# EAGLE design IRRxTx (EAGLE 7.1.0)
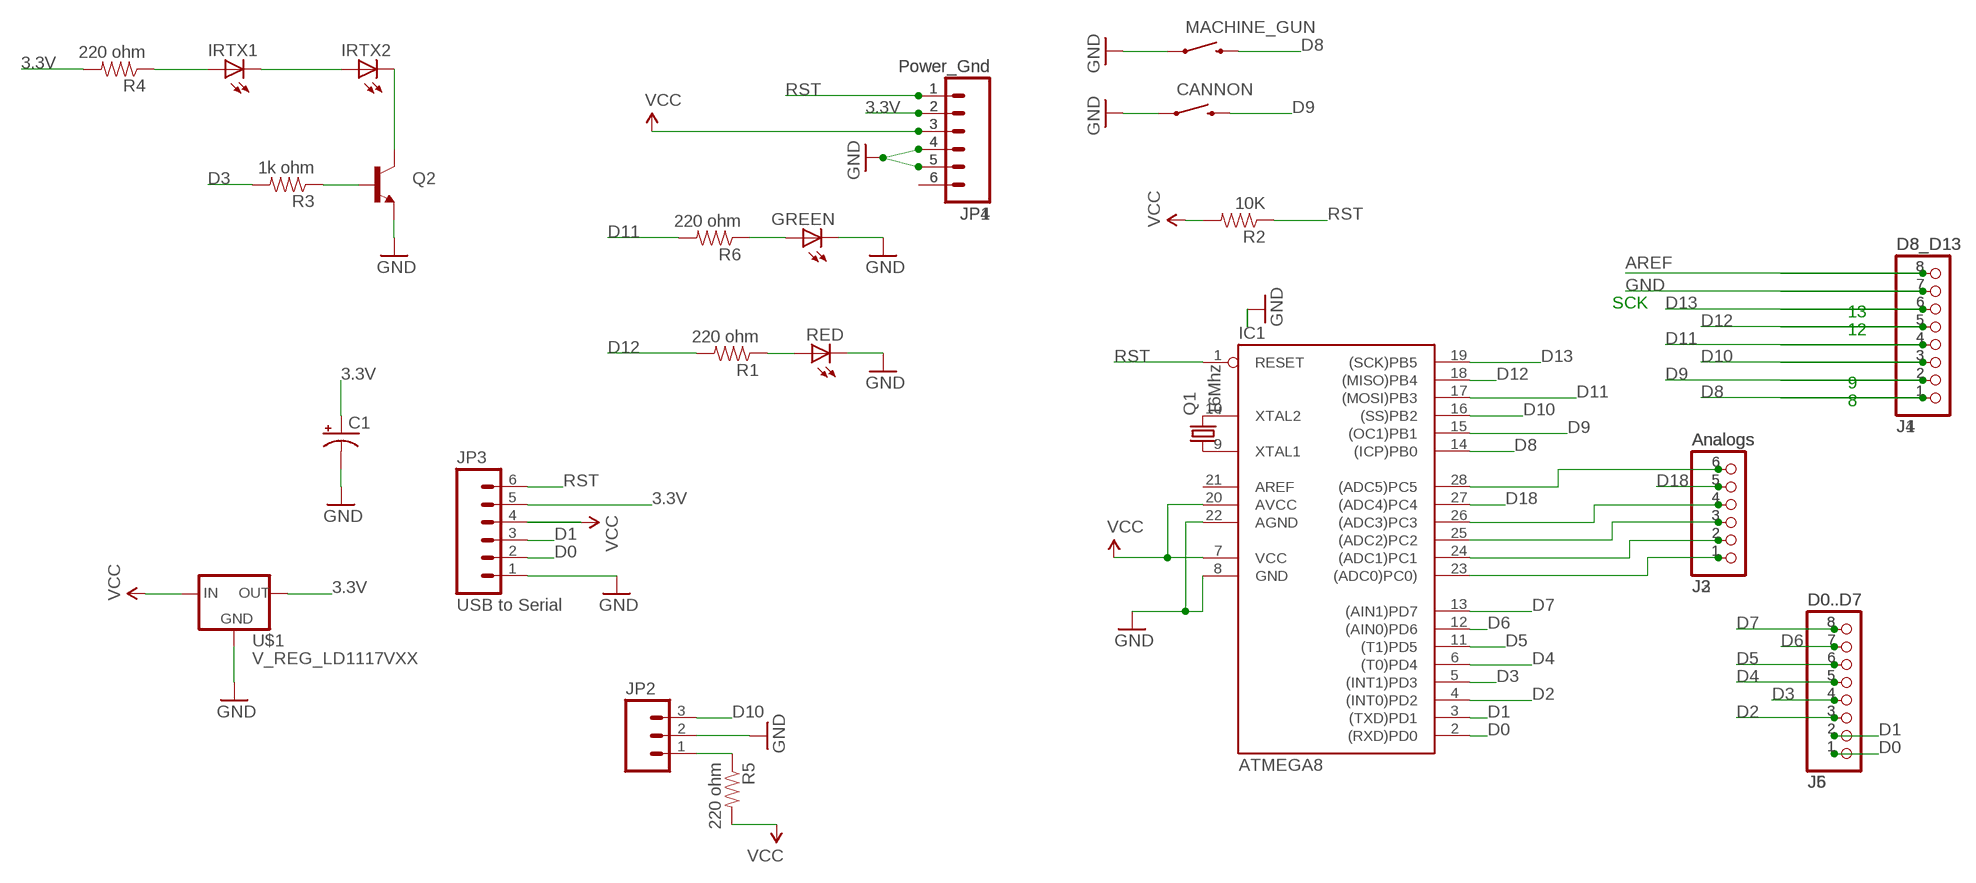
[diagram p0: schematic, sheet 1]

## Parts
C1  CAP_POLPTH2  [CPOL-RADIAL-10UF-25V]
CANNON  SWITCH-MOMENTARY-2PTH  [TACTILE-PTH]
GREEN  LED5MM  [LED5MM]
IC1  ATMEGA8  AT90S4433P  [DIL28-3]
IRTX1  LED5MM  [LED5MM]
IRTX2  LED5MM  [LED5MM]
J1  D8_D13  PINHD-1X8  [1X08]
J2  Analogs  PINHD-1X6  [1X06]
J3  Analogs  PINHD-1X6  [1X06]
J4  D8_D13  PINHD-1X8  [1X08]
J5  D0..D7  PINHD-1X8  [1X08]
J6  D0..D7  PINHD-1X8  [1X08]
JP1  Power_Gnd  M06SIP  [1X06]
JP2  M03PTH  [1X03]
JP3  USB to Serial  M06SIP  [1X06]
JP4  Power_Gnd  M06SIP  [1X06]
MACHINE_GUN  SWITCH-MOMENTARY-2PTH  [TACTILE-PTH]
Q1  16Mhz  CRYSTALHC49US  [HC49US]
Q2  TRANSISTOR_NPNTO92  [TO-92]
R1  220 ohm  RESISTORPTH1  [AXIAL-0.3]
R2  10K  RESISTORPTH1  [AXIAL-0.3]
R3  1k ohm  RESISTORPTH1  [AXIAL-0.3]
R4  220 ohm  RESISTORPTH1  [AXIAL-0.3]
R5  220 ohm  RESISTORPTH1  [AXIAL-0.3]
R6  220 ohm  RESISTORPTH1  [AXIAL-0.3]
RED  LED5MM  [LED5MM]
U$1  V_REG_LD1117VXX  [78XXL]

## Nets
3.3V: C1.1(+) JP1.2 JP3.5 JP4.2 R4.P$2 U$1.GND(OUT)
AREF [aref]: J1.8 J4.8
D0: IC1.2((RXD)PD0) J5.1 J6.1 JP3.2
D1: IC1.3((TXD)PD1) J5.2 J6.2 JP3.3
D2: IC1.4((INT0)PD2) J5.3 J6.3
D3: IC1.5((INT1)PD3) J5.4 J6.4 R3.P$2
D4: IC1.6((T0)PD4) J5.5 J6.5
D5: IC1.11((T1)PD5) J5.6 J6.6
D6: IC1.12((AIN0)PD6) J5.7 J6.7
D7: IC1.13((AIN1)PD7) J5.8 J6.8
D8: IC1.14((ICP)PB0) J1.1 J4.1 MACHINE_GUN.3
D9: CANNON.3 IC1.15((OC1)PB1) J1.2 J4.2
D10: IC1.16((SS)PB2) J1.3 J4.3 JP2.3
D11: IC1.17((MOSI)PB3) J1.4 J4.4 R6.P$2
D12: IC1.18((MISO)PB4) J1.5 J4.5 R1.P$2
D13: IC1.19((SCK)PB5) J1.6 J4.6
D18: IC1.27((ADC4)PC4) J2.5 J3.5
GND [gnd]: C1.2(-) CANNON.1 GREEN.K(C) IC1.8(GND) IC1.22(AGND) J1.7 J4.7 JP1.4 JP1.5 JP2.2 JP3.1 JP4.4 JP4.5 MACHINE_GUN.1 Q2.1(E) RED.K(C) U$1.IN(GND)
N$1: IC1.10(XTAL2) Q1.2
N$2: IC1.9(XTAL1) Q1.1
N$3: R1.P$1 RED.A
N$4: Q2.2(B) R3.P$1
N$5: IRTX2.K(C) Q2.3(C)
N$6: IRTX1.K(C) IRTX2.A
N$7: IRTX1.A R4.P$1
N$8: JP2.1 R5.P$1
N$9: GREEN.A R6.P$1
N$10: JP1.6 JP4.6
N$16: IC1.23((ADC0)PC0)) J2.1 J3.1
N$17: IC1.24((ADC1)PC1) J2.2 J3.2
N$18: IC1.25((ADC2)PC2) J2.3 J3.3
N$19: IC1.26((ADC3)PC3) J2.4 J3.4
N$21: IC1.28((ADC5)PC5) J2.6 J3.6
RST: IC1.1(RESET) JP1.1 JP3.6 JP4.1 R2.P$1
VCC: IC1.7(VCC) IC1.20(AVCC) JP1.3 JP3.4 JP4.3 R2.P$2 R5.P$2 U$1.OUT(IN)

## Notes on the sheet
- SCK
- 13
- 12
- 9
- 8

## Power pins joined to a net without a drawn wire
AREF: IC1.21(AREF)

## Library data of the parts
C1 = SparkFun:CAP_POL: Capacitor Polarized These are standard SMD and PTH capacitors. Normally 10uF, 47uF, and 100uF in electrolytic and tantalum varieties. Always verify the external diameter of the through hole cap, it varies with capacity, voltage, and manufacturer. The EIA devices should be standard.
CANNON MACHINE_GUN = SparkFun:SWITCH-MOMENTARY-2
GREEN IRTX1 IRTX2 RED = SparkFun:LED: LEDs Standard schematic elements and footprints for 5mm, 3mm, 1206, and 0603 sized LEDs. 5mm - Spark Fun Electronics SKU : COM-00529 (and others)
IC1 = atmel:AT90S4433: MICROCONTROLLER 4 Kbytes FLASH 128 bytes SRAM 256 bytes EEPROM UART 6-channel 10 bit ADC
J1 J4-J6 = pinhead:PINHD-1X8: PIN HEADER
J2 J3 = pinhead:PINHD-1X6: PIN HEADER
JP1 JP3 JP4 = SparkFun:M06: Header 6 Standard 6-pin 0.1" header. Use with straight break away headers (SKU : PRT-00116), right angle break away headers (PRT-00553), swiss pins (PRT-00743), machine pins (PRT-00117), and female headers (PRT-00115). Molex polarized connector foot print use with SKU : PRT-08094 with associated crimp pins and housings. NOTES ON THE VARIANTS LOCK and LOCK_LONGPADS... This footprint was designed to help hold the alignment of a through-hole component (i.e. 6-pin header) while soldering it into place. You may notice that each hole has been shifted either up or down by 0.005 of an inch from it's more standard position (which is a perfectly straight line). This slight alteration caused the pins (the squares in the middle) to touch the edges of the holes. Because they are alternating, it causes a "brace" to hold the component in place. 0.005 has proven to be the perfect amount of "off-center" position when using our standard breakaway headers. Although looks a little odd when you look at the bare footprint, once you have a header in there, the alteration is very hard to notice. Also, if you push a header all the way into place, it is covered up entirely on the bottom side. This idea of altering the position of holes to aid alignment will be further integrated into the Sparkfun Library for other footprints. It can help hold any component with 3 or more connection pins.
JP2 = SparkFun:M03: Header 3 Standard 3-pin 0.1" header. Use with straight break away headers (SKU : PRT-00116), right angle break away headers (PRT-00553), swiss pins (PRT-00743), machine pins (PRT-00117), and female headers (PRT-00115). Molex polarized connector foot print use with SKU : PRT-08232 with associated crimp pins and housings.
Q1 = SparkFun:CRYSTAL: Crystals Various standard crystals. Proven footprints. Spark Fun Electronics SKU : COM-00534
Q2 = SparkFun:TRANSISTOR_NPN: Transistor NPN BJT configuration in SOT23 package. MMBT2222 is the common NPN we use. Double check BCE configuration again layout.
R1-R6 = SparkFun:RESISTOR: Resistor Basic schematic elements and footprints for 0603, 1206, and PTH 1/10th watt (small) resistors.
U$1 = SparkFun:V_REG_LD1117VXX: LD1117VXX voltage regulator. We carry the 3.3V version (COM-00526) in TO-220 package.

## Net classes
0 default: width 0.254 mm, clearance 0.254 mm
1 power: width 0.61 mm, drill 0.711 mm, clearance 0.33 mm
2 gnd: width 0.305 mm, drill 0.711 mm, clearance 0.254 mm
3 usbvcc: width 0.508 mm, drill 0.711 mm, clearance 0.254 mm
4 aref: width 0.406 mm

## Board
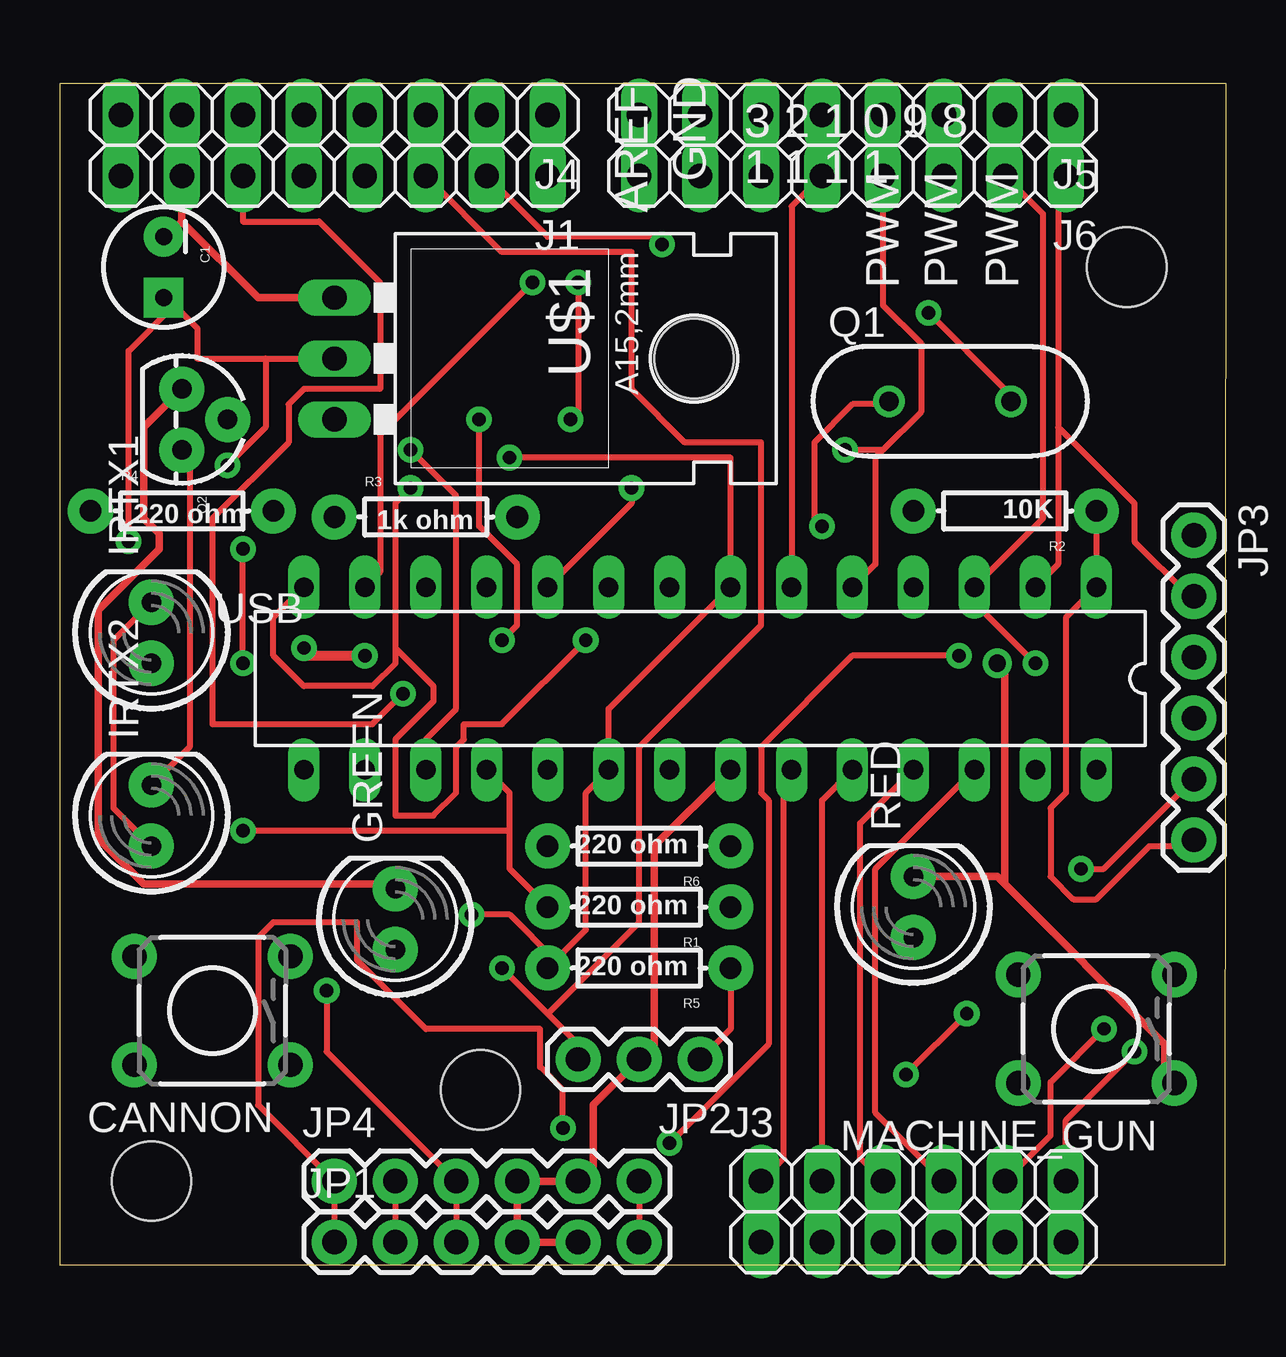
[diagram p1: board, top side]
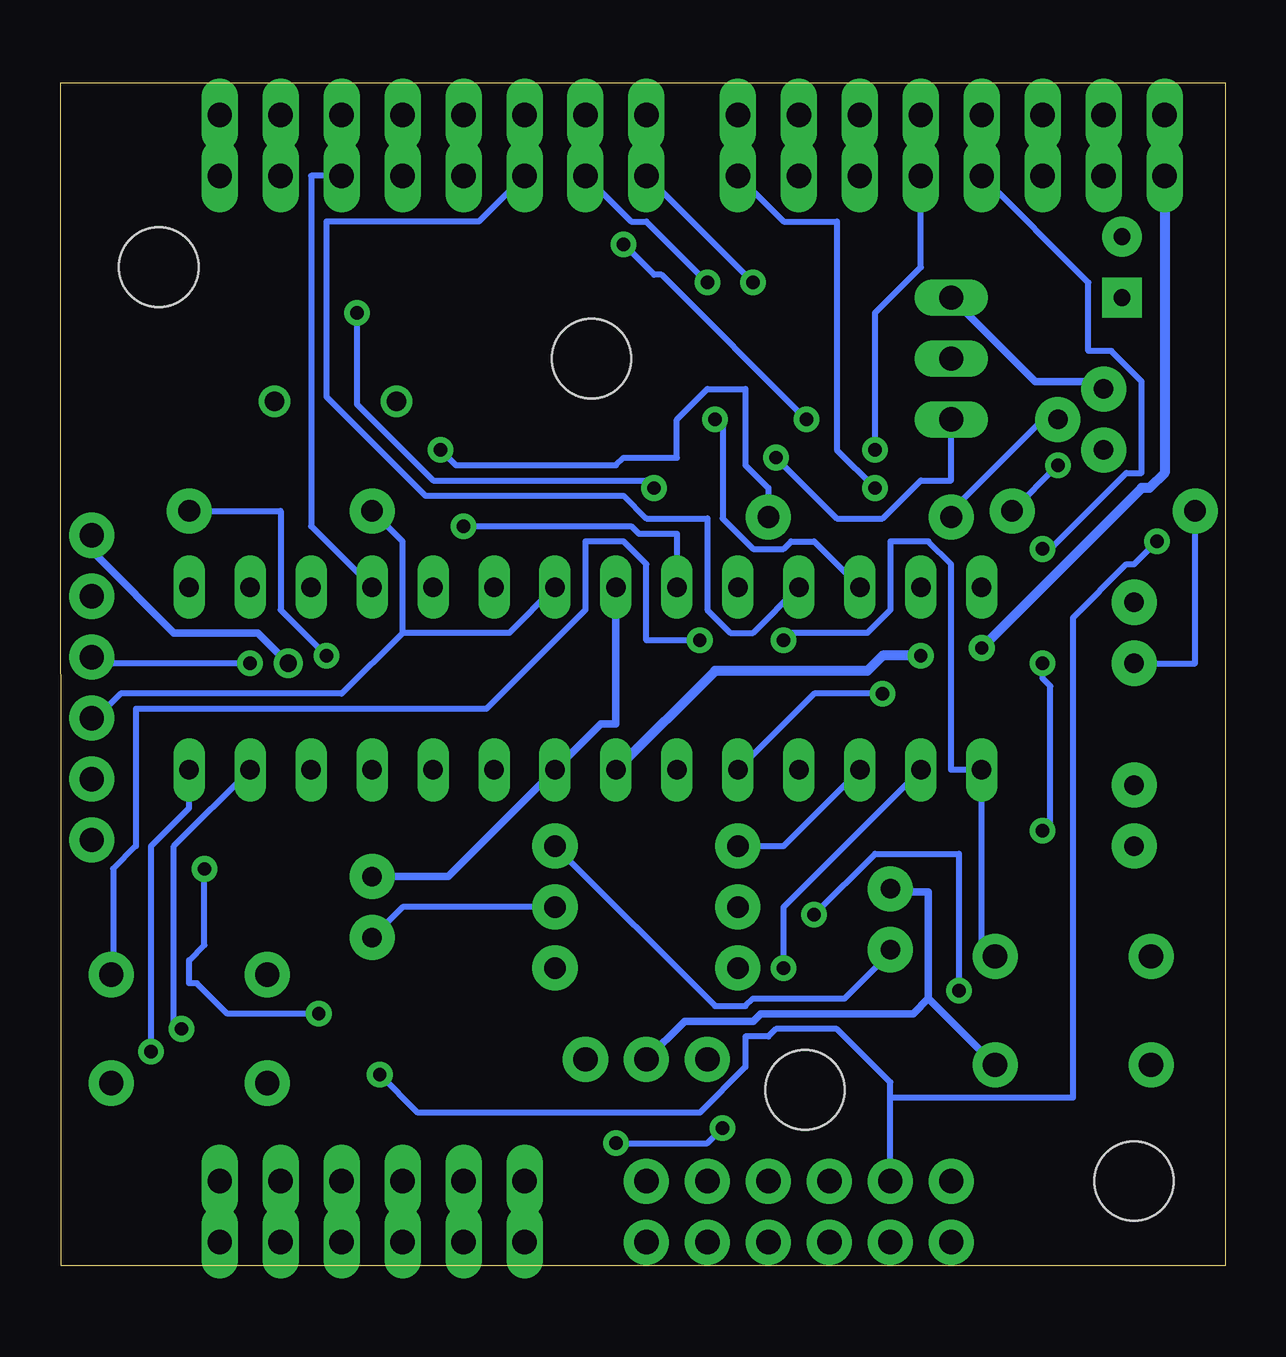
[diagram p2: board, bottom side, seen from below]

Size 48.56 x 49.28 mm. Coordinates in mm from the lower left corner, seen from the top.
Outline: 0,49.28 48.56,49.28 48.54,0 0,0 0,49.28
Copper layers (1*16): Top 0.035mm / dielectric 1.5mm / Bottom 0.035mm
Design rules "default": minimum track width 10mil, minimum drill 22mil, track to track 10mil, track to pad 10mil, pad to pad 10mil, via to via 16mil, smd to smd 8mil, copper to edge 30mil, drill to drill 12mil, minimum pad ring 10mil, minimum via ring 10mil, stop-mask expansion 4mil, vias tented up to drill 0mil, thermal gap 10mil
vRestrict: area 25.4,45.2 to 27.1,48.8; area 33.4,40.7 to 34.9,44.3; area 35.9,40.7 to 37.5,44.3; area 38.5,40.7 to 40,44.3; area 42.5,38.3 to 43.1,38.6

### Footprints (pad centres in the part's own frame; a part is rotated, then mirrored left to right if it is on the bottom)
CPOL-RADIAL-10UF-25V = drill 0.7 pad 1.651 square: 1 1.27,0 | drill 0.7 pad 1.651: 2 -1.27,0
TACTILE-PTH = drill 1.016 pad 1.88: 1 -3.251,2.261; 2 3.251,2.261; 3 -3.251,-2.261; 4 3.251,-2.261
LED5MM = drill 0.813 pad 1.88: A -1.27,0; K 1.27,0
DIL28-3 = drill 0.813 long: 1 -16.51,-3.81; 2 -13.97,-3.81; 3 -11.43,-3.81; 4 -8.89,-3.81; 5 -6.35,-3.81; 6 -3.81,-3.81; 7 -1.27,-3.81; 8 1.27,-3.81; 9 3.81,-3.81; 10 6.35,-3.81; 11 8.89,-3.81; 12 11.43,-3.81; 13 13.97,-3.81; 14 16.51,-3.81; 15 16.51,3.81; 16 13.97,3.81; 17 11.43,3.81; 18 8.89,3.81; 19 6.35,3.81; 20 3.81,3.81; 21 1.27,3.81; 22 -1.27,3.81; 23 -3.81,3.81; 24 -6.35,3.81; 25 -8.89,3.81; 26 -11.43,3.81; 27 -13.97,3.81; 28 -16.51,3.81
1X08 = drill 1.016 long: 1 -8.89,0; 2 -6.35,0; 3 -3.81,0; 4 -1.27,0; 5 1.27,0; 6 3.81,0; 7 6.35,0; 8 8.89,0
1X06 = drill 1.016 long: 1 -6.35,0; 2 -3.81,0; 3 -1.27,0; 4 1.27,0; 5 3.81,0; 6 6.35,0
1X06' = drill 1.016 pad 1.88: 1 0,0; 2 2.54,0; 3 5.08,0; 4 7.62,0; 5 10.16,0; 6 12.7,0
1X03 = drill 1.016 pad 1.88: 1 0,0; 2 2.54,0; 3 5.08,0
HC49US = drill 0.813: 1 -2.54,0; 2 2.54,0
TO-92 = drill 0.813 pad 1.88: 1 -1.27,0; 2 0,1.905; 3 1.27,0
AXIAL-0.3 = drill 0.9 pad 1.88: P$1 -3.81,0; P$2 3.81,0
78XXL = drill 1.016 long: GND 0,-3.81; IN -2.54,-3.81; OUT 2.54,-3.81 | hole 3.302: 0,11.176
STAND-OFF = hole 3.302: 0,0

### Placement (x,y rotation side)
C1  4.32,41.61 270 top
CANNON  6.35,10.62 180 top
GREEN  13.97,14.43 90 top
IC1  26.67,24.46 180 top
IRTX1  3.81,26.37 90 top
IRTX2  3.81,18.75 90 top
J1  11.43,45.42 180 top
J2  35.56,0.97 0 top
J3  35.56,3.51 0 top
J4  11.43,47.96 180 top
J5  33.02,47.96 180 top
J6  33.02,45.42 180 top
JP1  Power_Gnd  [1X06']  11.43,0.97 0 top
JP2  26.67,8.59 180 top
JP3  USB to Serial  [1X06']  47.24,30.43 270 top
JP4  Power_Gnd  [1X06']  11.43,3.51 0 top
MACHINE_GUN  43.18,9.86 180 top
Q1  37.08,36.02 0 top
Q2  5.08,35.26 270 top
R1  24.13,14.94 180 top
R2  39.37,31.45 180 top
R3  15.24,31.19 0 top
R4  5.08,31.45 0 top
R5  24.13,12.4 180 top
R6  24.13,17.48 180 top
RED  35.56,14.94 90 top
U$1  15.24,37.8 270 top
U$2  [STAND-OFF]  44.45,41.61 0 top
U$3  [STAND-OFF]  3.81,3.51 0 top
U$4  [STAND-OFF]  17.53,7.32 0 top

### Tracks (layer width: path | path; a pad name or v marks a point on that pad's centre or on a via)
3.3V  (via drill 0.56)
  Top 0.254: 8.57,37.8 5.71,37.8 5.71,39.07 4.76,40.02 | 8.57,37.8 U$1.GND | 4.76,40.02 4.45,40.34 C1.1 4.76,40.02 | v6.99,33.35 8.57,34.94 8.57,37.8 | JP4.2 JP1.2 | JP3.5 43.5,16.52 v42.55,16.52 | v35.24,7.95 v37.78,10.49 | 4.76,40.02 2.86,38.11 v2.86,30.18
  Bottom 0.254: v6.99,33.35 R4.P$2 | v42.55,16.52 42.55,13.35 43.18,12.71 43.18,11.76 42.86,11.76 41.59,10.49 v37.78,10.49 | v35.24,7.95 33.66,6.36 21.91,6.36 20,8.27 20,9.54 19.05,9.54 18.73,9.86 16.19,9.86 13.97,7.63 13.97,7 | JP4.2 13.97,7 | v2.86,30.18 3.81,29.22 4.13,29.22 6.35,27 6.35,7 13.97,7
AREF  (via drill 0.56)
  Top 0.406: v12.7,25.41 10.16,25.41 v10.16,25.73 | J1.8 J4.8
  Bottom 0.406: IC1.21 21.27,24.78 14.92,24.78 14.29,25.41 v12.7,25.41 | v10.16,25.73 3.49,32.4 3.17,32.4 2.54,33.03 J1.8
D0
  Top 0.254: IC1.2 41.59,29.22 41.59,34.94 | 41.59,34.94 41.59,45.1 J6.1 J5.1 | 41.59,34.94 44.77,31.76 44.77,30.18 46.99,27.95 JP3.2
D1  (via drill 0.56)
  Top 0.254: J5.2 J6.2 40.96,43.83 40.96,31.13 IC1.3 38.1,27.64 v40.64,25.1
  Bottom 0.254: v40.64,25.1 46.99,25.1 JP3.3
D2
  Top 0.254: J6.3 J5.3
  Bottom 0.254: IC1.4 38.1,30.81 38.1,45.42 J6.3
D3  (via drill 0.56)
  Top 0.254: IC1.5 33.97,29.22 33.97,33.67 34.29,33.99 | 34.29,33.99 35.88,35.57 35.88,38.43 34.29,40.02 J6.4 J5.4 | 34.29,33.99 v32.7,33.99
  Bottom 0.254: R3.P$2 19.05,32.4 20,33.35 20,36.53 21.59,36.53 22.86,35.26 22.86,33.67 25.08,33.67 25.4,33.35 32.07,33.35 v32.7,33.99
D4
  Top 0.254: IC1.6 30.48,44.15 J6.5 J5.5
D5
  Top 0.254: J6.6 J5.6
  Bottom 0.254: IC1.11 19.68,26.37 20.64,26.37 21.59,27.32 21.59,31.13 24.13,31.13 25.08,32.08 33.34,32.08 37.47,36.21 37.47,43.51 31.11,43.51 J6.6
D6  (via drill 0.56)
  Top 0.254: v21.27,35.26 21.59,35.57 v21.59,40.97 | J6.7 J5.7
  Bottom 0.254: IC1.12 17.14,30.18 18.1,30.18 18.41,29.86 19.68,29.86 20.95,31.13 20.95,35.26 v21.27,35.26 | v21.59,40.97 24.13,43.51 24.77,43.51 J6.7
D7  (via drill 0.56)
  Top 0.254: IC1.13 13.34,28.91 13.34,34.62 v19.68,40.97 | J6.8 J5.8
  Bottom 0.254: J6.8 v19.68,40.97
D8  (via drill 0.56)
  Top 0.254: IC1.14 8.89,27 8.89,25.41 10.16,24.14 13.02,24.14 13.97,25.1 13.97,25.73 | 13.97,25.73 13.97,31.76 v14.61,32.4 | J1.1 J4.1 | v21.91,26.05 18.41,22.56 16.83,22.56 16.83,21.92 16.51,21.6 16.51,19.7 15.56,18.75 13.97,18.75 13.97,21.92 15.56,23.51 15.56,24.14 13.97,25.73
  Bottom 0.254: v14.61,32.4 16.19,33.99 16.19,43.51 18.41,43.51 J1.1 | v21.91,26.05 24.13,26.05 24.13,29.22 25.08,30.18 26.67,30.18 26.67,27.32 30.8,23.19 45.4,23.19 45.4,17.48 46.35,16.52 46.35,12.4 MACHINE_GUN.3
D9  (via drill 0.56)
  Top 0.254: J4.2 J1.2 20.32,42.88 25.08,42.88 v25.08,42.56 | v17.46,35.26 17.46,30.81 19.05,29.22 19.05,26.68 v18.41,26.05
  Bottom 0.254: CANNON.3 9.84,13.03 10.16,13.03 IC1.15 11.43,20.65 11.43,29.22 12.38,30.18 13.97,30.18 13.97,27.32 14.92,26.37 18.1,26.37 v18.41,26.05 | v25.08,42.56 23.81,41.29 23.5,41.29 v17.46,35.26
D10  (via drill 0.56)
  Top 0.254: J4.3 J1.3 18.41,42.24 23.81,42.24 23.81,36.53 26.04,34.3 29.21,34.3 29.21,26.68 24.13,21.6 24.13,14.3 20.32,10.49 | 20.32,10.49 21.59,9.22 JP2.3 | 20.32,10.49 v18.41,12.4
  Bottom 0.254: IC1.16 18.41,14.94 v18.41,12.4
D11  (via drill 0.56)
  Top 0.254: J4.4 J1.4 | v14.61,33.99 16.51,32.08 16.51,23.19 15.24,21.92 IC1.17
  Bottom 0.254: IC1.17 18.41,17.48 R6.P$2 | J1.4 12.7,41.61 14.61,39.7 v14.61,33.99
D12  (via drill 0.56)
  Top 0.254: J4.5 J1.5 | IC1.18 18.73,19.7 18.73,18.11 | 18.73,18.11 18.73,16.52 R1.P$2 | v7.62,25.1 v7.62,29.86 | 18.73,18.11 v7.62,18.11
  Bottom 0.254: J1.5 5.71,40.97 5.71,38.11 4.76,38.11 3.49,36.84 3.49,33.03 4.13,33.03 7.3,29.86 v7.62,29.86 | v7.62,25.1 7.62,24.46 7.3,24.14 7.3,18.11 v7.62,18.11
D13  (via drill 0.56)
  Top 0.254: v14.29,23.83 13.02,22.56 6.35,22.56 6.35,31.13 9.53,34.3 9.53,35.89 10.16,36.53 13.34,36.53 13.34,40.97 10.79,43.51 7.62,43.51 J1.6 J4.6
  Bottom 0.254: IC1.19 17.14,23.83 v14.29,23.83
D18  (via drill 0.56)
  Top 0.254: v43.5,9.86 41.27,7.63 41.27,5.41 J3.5 J2.5
  Bottom 0.254: IC1.27 43.81,17.48 43.81,9.86 v43.5,9.86
GND  (via drill 0.71)
  Top 0.305: 39.37,15.89 39.05,16.21 RED.K | 39.37,15.89 46.04,9.22 46.04,7.95 46.35,7.63 MACHINE_GUN.1 | v39.05,25.1 39.37,24.78 39.37,15.89 | J4.7 J1.7 5.08,43.51 | 5.08,43.51 4.45,42.88 C1.2 | 5.08,43.51 8.26,40.34 U$1.IN | JP1.5 JP1.4 JP4.4 JP4.5 22.23,4.14 22.23,6.68 JP2.2 24.77,9.22 24.77,17.48 IC1.22 | Q2.1 3.49,34.94 3.49,31.13 4.13,30.49 4.13,29.86 1.59,27.32 1.59,17.79 3.49,15.89 13.97,15.89 GREEN.K
  Bottom 0.305: RED.K 32.38,16.21 IC1.22 26.04,22.56 25.4,22.56 IC1.8 | v39.05,25.1 40.32,26.37 43.81,26.37 46.99,29.54 46.99,30.18 JP3.1 | U$1.IN 7.94,36.84 5.4,36.84 Q2.1 | 12.38,11.13 9.84,8.59 CANNON.1 | 12.38,11.13 12.38,15.57 13.97,15.57 GREEN.K | 12.38,11.13 13.02,10.49 19.37,10.49 19.68,10.17 22.54,10.17 JP2.2
N$1  (via drill 0.56)
  Top 0.254: IC1.10 23.81,31.76 v23.81,32.4 | v36.2,39.7 39.37,36.53 39.37,36.21 Q1.2
  Bottom 0.254: v23.81,32.4 24.13,32.72 33.02,32.72 36.2,35.89 v36.2,39.7
N$2  (via drill 0.56)
  Top 0.254: v31.75,30.81 31.43,31.13 31.43,34.3 33.02,35.89 34.29,35.89 Q1.1
  Bottom 0.254: IC1.9 22.86,30.49 24.45,30.49 24.77,30.81 v31.75,30.81
N$3
  Bottom 0.254: RED.A 34.29,14.94 R1.P$1
N$4
  Bottom 0.254: Q2.2 7.62,35.26 11.43,31.45 R3.P$1
N$5
  Top 0.254: IRTX2.K 5.4,21.6 5.4,33.67 Q2.3
N$6
  Top 0.254: IRTX2.A 2.22,19.06 2.22,26.05 IRTX1.K
N$7
  Bottom 0.254: R4.P$1 1.27,25.1 IRTX1.A
N$8
  Top 0.254: JP2.1 27.94,9.86 R5.P$1
N$9
  Bottom 0.254: R6.P$1 21.27,10.81 20,10.81 19.68,11.13 15.88,11.13 13.97,13.03 GREEN.A
N$10
  Top 0.254: JP4.6 JP1.6
N$16
  Top 0.254: IC1.23 30.16,20.33 30.16,4.46 J3.1 J2.1
N$17
  Top 0.254: IC1.24 31.75,19.38 J3.2 J2.2
N$18
  Top 0.254: IC1.25 33.34,18.43 33.34,4.46 J3.3 J2.3
N$19
  Top 0.254: IC1.26 33.97,16.52 33.97,6.36 J3.4 J2.4
N$21  (via drill 0.56)
  Top 0.254: v44.77,8.9 41.91,6.05 J3.6 J2.6
  Bottom 0.254: IC1.28 43.18,19.06 44.77,17.48 v44.77,8.9
RST  (via drill 0.56)
  Top 0.254: JP1.1 JP4.1 8.26,6.68 8.26,13.67 8.89,14.3 12.38,14.3 12.38,12.71 15.24,9.86 20,9.86 20,8.27 20.95,7.32 v20.95,5.73 | R2.P$1 IC1.1 41.91,27 41.91,19.7 41.27,19.06 41.27,16.21 42.23,15.25 43.18,15.25 45.4,17.48 46.99,17.48 JP3.6 | v25.4,5.09 29.53,9.22 29.53,19.38 29.21,19.7 29.21,21.6 33.02,25.41 v37.47,25.41
  Bottom 0.254: v20.95,5.73 21.59,5.09 v25.4,5.09 | v37.47,25.41 39.37,27.32 39.37,31.45 R2.P$1
VCC  (via drill 0.56)
  Top 0.254: JP1.3 JP4.3 11.11,8.9 v11.11,11.44 | 20.64,12.71 21.91,13.98 21.91,19.7 IC1.20 22.86,23.19 IC1.7 27.94,33.67 v18.73,33.67 | v17.14,14.62 18.73,14.62 20.64,12.71 | 20.64,12.71 R5.P$2
  Bottom 0.254: U$1.OUT 11.43,32.72 12.7,32.72 14.29,31.13 16.19,31.13 v18.73,33.67 | R2.P$2 34.29,30.18 34.29,26.37 | 34.29,26.37 29.84,26.37 IC1.7 | 34.29,26.37 36.83,23.83 46.04,23.83 46.99,22.87 JP3.4 | v11.11,11.44 11.11,17.16 14.61,17.16 v17.14,14.62

### Text on the board
tNames: 3 2 1 0 9 8 | GND | 1 1 1 1 | AREF | PWM | PWM | PWM | USB
Reference: C8 | C2 | R11 | C4 | C5